# EAGLE schematic humidor_schematics (EAGLE 7.2.0)
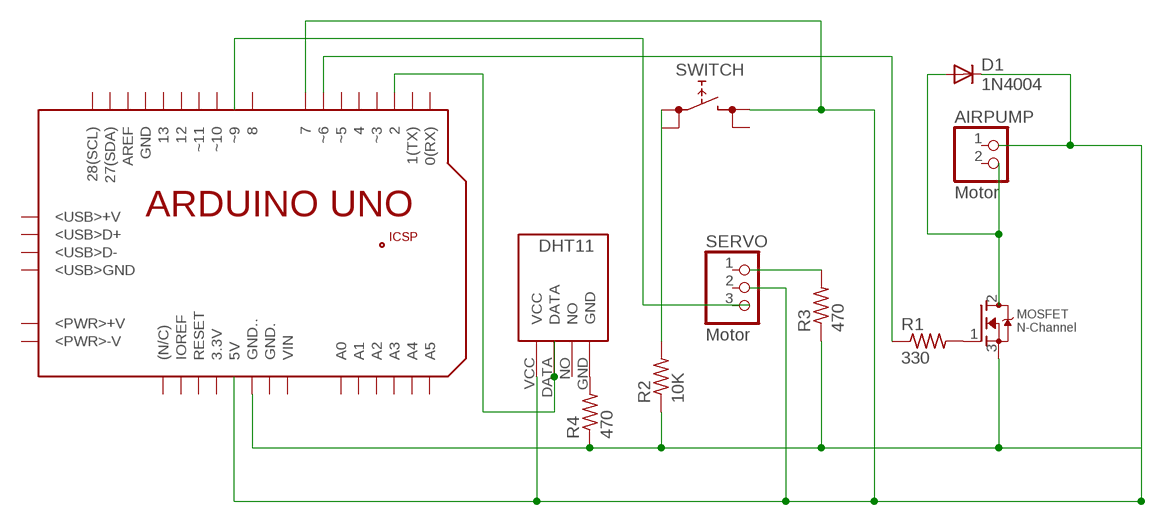
[diagram p0: schematic, sheet 1]

## Parts
AIRPUMP  Motor  PINHD-1X2  [1X02]
D1  1N4004  [DO41-10]
MOSFET  N-Channel  MOSFET-NGDS_TO220V  [TO220V]
PCB1  ARDUINO_UNO_EXT  (no package)
R1  330  R-US_0204/5  [0204/5]
R2  10K  R-US_0204/5  [0204/5]
R3  470  R-US_0204/5  [0204/5]
R4  470  R-US_0204/5  [0204/5]
SERVO  Motor  PINHD-1X3  [1X03]
SWITCH  REKN  [REKN]
U$1  DHT11  [DHT11]

## Nets
N$1: D1.C PCB1.7 SWITCH.1A U$1.VCC
N$2: MOSFET.3(S) PCB1.GND.. R2.1 R3.1 R4.1
N$3: PCB1.2 U$1.DATA
N$4: R4.2 U$1.GND
N$6: R3.2
N$7: R2.2 SWITCH.0A
N$8: PCB1.~6 R1.1
N$10: D1.A
N$11: MOSFET.1(G) R1.2
Unconnected: AIRPUMP.1 AIRPUMP.2 MOSFET.2(D) PCB1.0(RX) PCB1.1(TX) PCB1.3.3V PCB1.4 PCB1.5V PCB1.8 PCB1.12 PCB1.13 PCB1.27(SDA) PCB1.28(SCL) PCB1.(N/C) PCB1.+5V PCB1.<PWR>+V PCB1.<PWR>-V PCB1.<USB>+V PCB1.<USB>D+ PCB1.<USB>D- PCB1.<USB>GND PCB1.A0 PCB1.A1 PCB1.A2 PCB1.A3 PCB1.A4 PCB1.A5 PCB1.AREF PCB1.GND PCB1.GND. PCB1.GND_ PCB1.IOREF PCB1.MISO PCB1.MOSI PCB1.RESET PCB1.RESET. PCB1.SCK PCB1.VIN PCB1.~3 PCB1.~5 PCB1.~9 PCB1.~10 PCB1.~11 SERVO.1 SERVO.2 SERVO.3 SWITCH.0B SWITCH.1B U$1.NO

## Library data of the parts
AIRPUMP = pinhead:PINHD-1X2: PIN HEADER
D1 = adafruit:1N4004: DIODE General purpose 1N400x type rectifier (With bigger pads) http://www.ladyada.net/library/pcb/eaglelibrary.html
MOSFET = adafruit:MOSFET-N: N-Channel Mosfet 2N7002E - 60V 260mA SOT23 [Digikey: 2N7002ET1GOSTR-ND] - REEL BSH103 - 30V 850mA SOT23 [Digikey: 568-5013-1-ND]
PCB1 = E14_Arduino_published:ARDUINO_UNO_EXT: Device for representing an Arduino Uno board in an EAGLE design without the PCB footprint. Created by Dave Young for Element14. More EAGLE documentation at: http://www.element14.com/community/community/knode/cadsoft_eagle
R1-R4 = resistor:R-US_: RESISTOR, American symbol
SERVO = pinhead:PINHD-1X3: PIN HEADER
SWITCH = switch:REKN: PUSH SWITCH ITT-Cannon-Cannon
U$1 = DHT11:DHT11: DHT11 Czujnik temperatury i wilgotności